# EAGLE design M307foo (EAGLE 4.11)
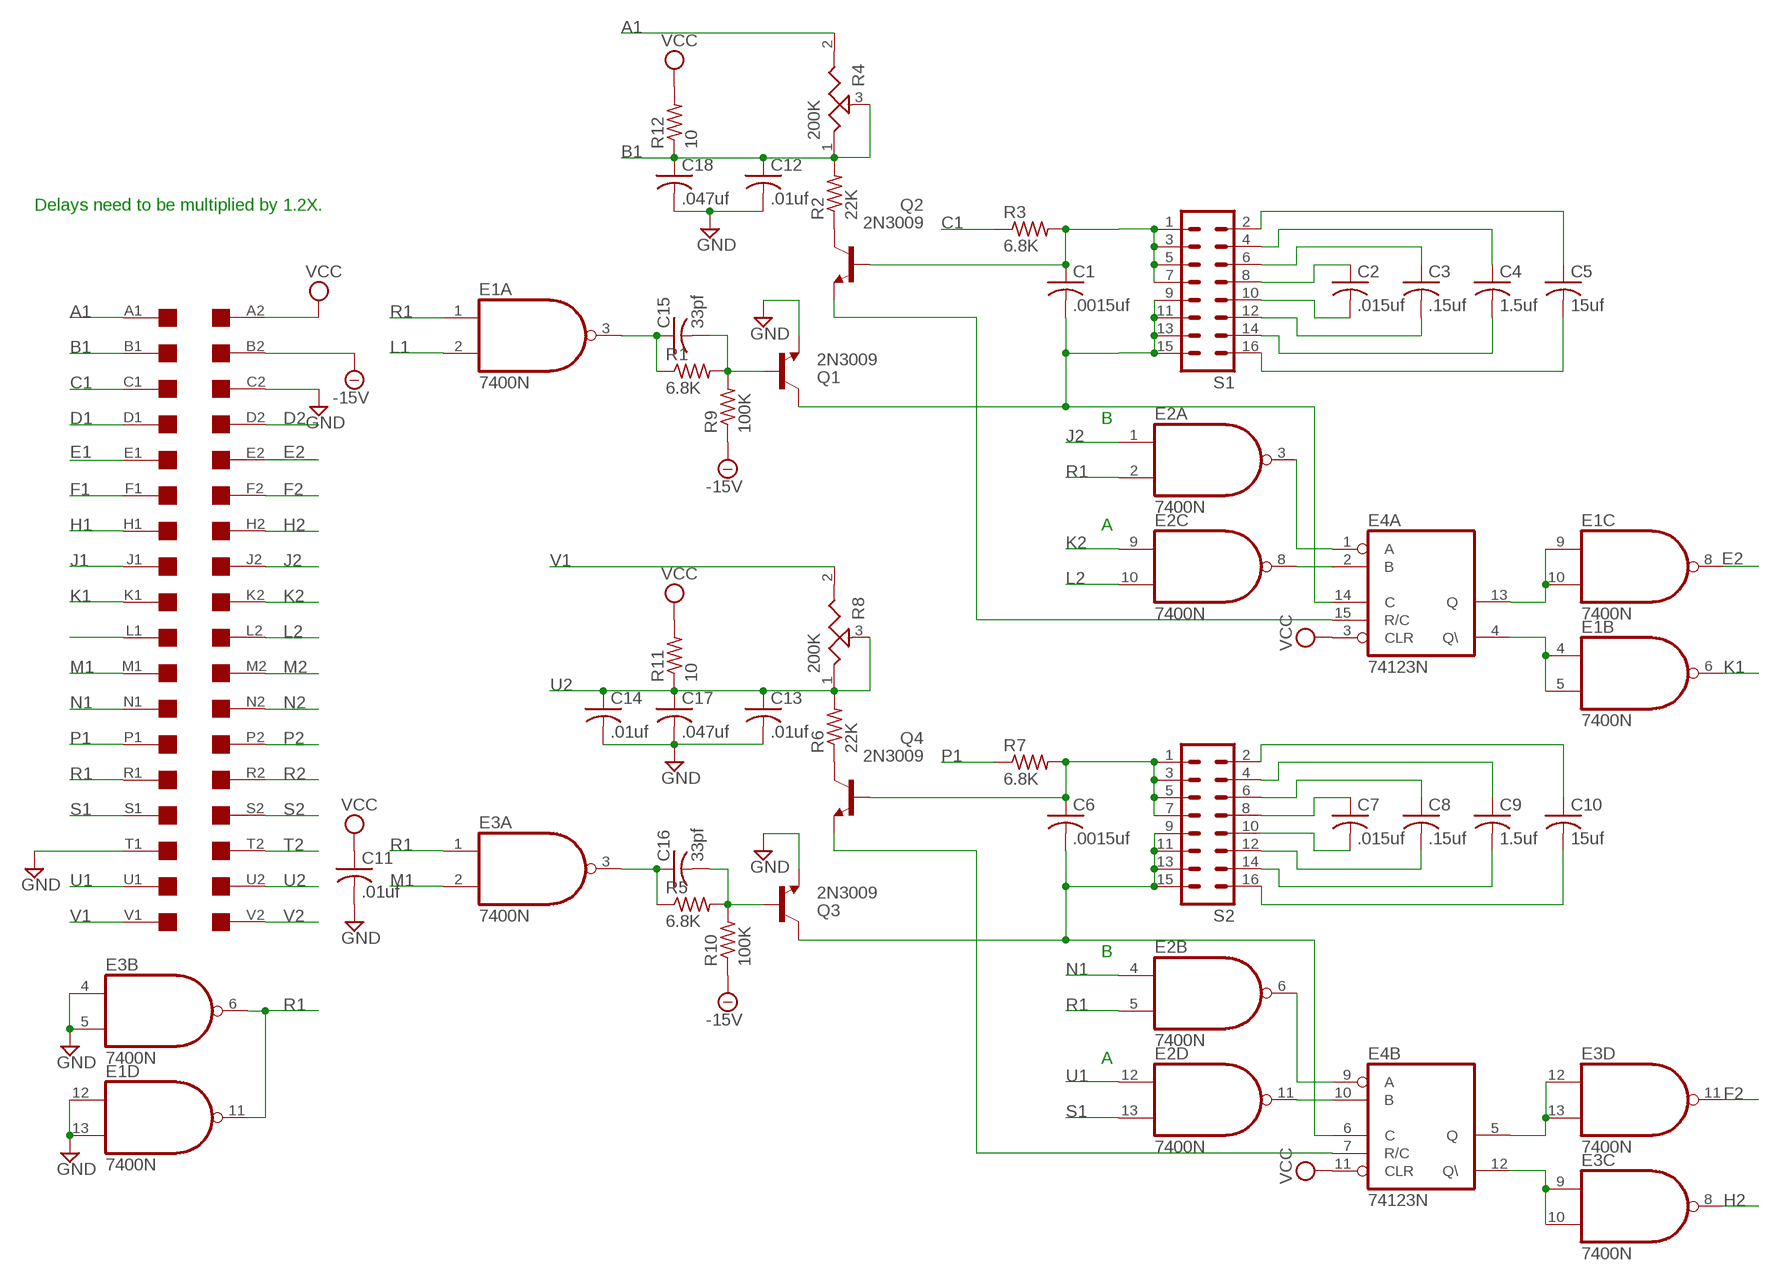
[diagram p0: schematic, sheet 1]

## Parts
A  DEC-FLIPCHIP  [DEC-FLIPCHIP]
C1  .0015uf  C-US050-025X075  [C050-025X075]
C2  .015uf  C-US050-025X075  [C050-025X075]
C3  .15uf  C-US050-025X075  [C050-025X075]
C4  1.5uf  C-US050-025X075  [C050-025X075]
C5  15uf  C-US050-025X075  [C050-025X075]
C6  .0015uf  C-US050-025X075  [C050-025X075]
C7  .015uf  C-US050-025X075  [C050-025X075]
C8  .15uf  C-US050-025X075  [C050-025X075]
C9  1.5uf  C-US050-025X075  [C050-025X075]
C10  15uf  C-US050-025X075  [C050-025X075]
C11  .01uf  C-US050-025X075  [C050-025X075]
C12  .01uf  C-US050-025X075  [C050-025X075]
C13  .01uf  C-US050-025X075  [C050-025X075]
C14  .01uf  C-US050-025X075  [C050-025X075]
C15  33pf  C-US050-025X075  [C050-025X075]
C16  33pf  C-US050-025X075  [C050-025X075]
C17  .047uf  C-US050-025X075  [C050-025X075]
C18  .047uf  C-US050-025X075  [C050-025X075]
E1  7400N  [DIL14]
E2  7400N  [DIL14]
E3  7400N  [DIL14]
E4  74123N  [DIL16]
Q1  2N3009  2N3019-NPN-TO39-EBC  [TO39]
Q2  2N3009  2N3019-NPN-TO39-EBC  [TO39]
Q3  2N3009  2N3019-NPN-TO39-EBC  [TO39]
Q4  2N3009  2N3019-NPN-TO39-EBC  [TO39]
R1  6.8K  R-US_0207/10  [0207/10]
R2  22K  R-US_0207/10  [0207/10]
R3  6.8K  R-US_0207/10  [0207/10]
R4  200K  POTUS-TRIM  [PT-SPIN]
R5  6.8K  R-US_0207/10  [0207/10]
R6  22K  R-US_0207/10  [0207/10]
R7  6.8K  R-US_0207/10  [0207/10]
R8  200K  POTUS-TRIM  [PT-SPIN]
R9  100K  R-US_0207/10  [0207/10]
R10  100K  R-US_0207/10  [0207/10]
R11  10  R-US_0207/10  [0207/10]
R12  10  R-US_0207/10  [0207/10]
S1  MA08-2  [MA08-2]
S2  MA08-2  [MA08-2]

## Nets
-15V: A.B2 R9.1 R10.1
A1: A.A1 R4.2
B1: A.B1 C12.1 C18.1 R2.2 R4.1 R4.3 R12.1
C1: A.C1 R3.1
CX1: C1.2 E4.14(A:C) Q1.3(C) S1.9 S1.11 S1.13 S1.15
CX2: C6.2 E4.6(B:C) Q3.3(C) S2.9 S2.11 S2.13 S2.15
D1: A.D1
D2: A.D2
E1: A.E1
E2: A.E2 E1.8(C:O)
F1: A.F1
F2: A.F2 E3.11(D:O)
GND: A.C2 A.T1 C11.2 C12.2 C13.2 C14.2 C17.2 C18.2 E1.12(D:I0) E1.13(D:I1) E3.4(B:I0) E3.5(B:I1) Q1.1(E) Q3.1(E)
H1: A.H1
H2: A.H2 E3.8(C:O)
J1: A.J1
J2: A.J2 E2.1(A:I0)
K1: A.K1 E1.6(B:O)
K2: A.K2 E2.9(C:I0)
L1: A.L1 E1.2(A:I1)
L2: A.L2 E2.10(C:I1)
M1: A.M1 E3.2(A:I1)
M2: A.M2
N1: A.N1 E2.4(B:I0)
N2: A.N2
N$1: C1.1 Q2.2(B) R3.2 S1.1 S1.3 S1.5 S1.7
N$2: E4.15(A:R/C) Q2.1(E)
N$3: C4.2 S1.14
N$4: C4.1 S1.4
N$5: C3.1 S1.6
N$6: C3.2 S1.12
N$7: C2.2 S1.10
N$8: C2.1 S1.8
N$9: C5.2 S1.16
N$10: C5.1 S1.2
N$11: E2.3(A:O) E4.1(A:A)
N$12: E2.8(C:O) E4.2(A:B)
N$13: E2.6(B:O) E4.9(B:A)
N$14: E2.11(D:O) E4.10(B:B)
N$15: E4.7(B:R/C) Q4.1(E)
N$16: Q2.3(C) R2.1
N$17: C6.1 Q4.2(B) R7.2 S2.1 S2.3 S2.5 S2.7
N$18: C10.2 S2.16
N$19: C10.1 S2.2
N$20: C9.1 S2.4
N$21: C8.1 S2.6
N$22: C7.1 S2.8
N$23: C7.2 S2.10
N$24: C8.2 S2.12
N$25: C9.2 S2.14
N$26: Q4.3(C) R6.1
N$27: E1.9(C:I0) E1.10(C:I1) E4.13(A:Q)
N$28: E1.4(B:I0) E1.5(B:I1) E4.4(A:Q\)
N$29: E3.12(D:I0) E3.13(D:I1) E4.5(B:Q)
N$30: C15.1 E1.3(A:O) R1.1
N$31: C15.2 Q1.2(B) R1.2 R9.2
N$32: E3.9(C:I0) E3.10(C:I1) E4.12(B:Q\)
N$33: C16.2 Q3.2(B) R5.2 R10.2
N$34: C16.1 E3.3(A:O) R5.1
P1: A.P1 R7.1
P2: A.P2
R1: A.R1 E1.1(A:I0) E1.11(D:O) E2.2(A:I1) E2.5(B:I1) E3.1(A:I0) E3.6(B:O)
R2: A.R2
S1: A.S1 E2.13(D:I1)
S2: A.S2
T2: A.T2
U1: A.U1 E2.12(D:I0)
U2: A.U2 C13.1 C14.1 C17.1 R6.2 R8.1 R8.3 R11.1
V1: A.V1 R8.2
V2: A.V2
VCC: A.A2 C11.1 E4.3(A:CLR) E4.11(B:CLR) R11.2 R12.2

## Notes on the sheet
- Delays need to be multiplied by 1.2X.
- B
- A
- B
- A

## Power pins joined to a net without a drawn wire
GND: E1.7(P:GND) E2.7(P:GND) E3.7(P:GND) E4.8(P:GND)
VCC: E1.14(P:VCC) E2.14(P:VCC) E3.14(P:VCC) E4.16(P:VCC)

## Library data of the parts
A = con-dec:DEC-FLIPCHIP: Two-sided DEC Flip-Chip single card fingers
C1-C18 = rcl:C-US: CAPACITOR, American symbol
E1-E3 = 74xx-us:74*00: Quad 2-input NAND gate
E4 = 74xx-us:74*123: Retriggerable monostable MULTIVIBRATOR
Q1-Q4 = transistor:*-NPN-: NPN Transistror
R1-R3 R5-R7 R9-R12 = rcl:R-US_: RESISTOR, American symbol
R4 R8 = discrete:POTUS-TRIM
S1 S2 = con-lstb:MA08-2: PIN HEADER

## Board
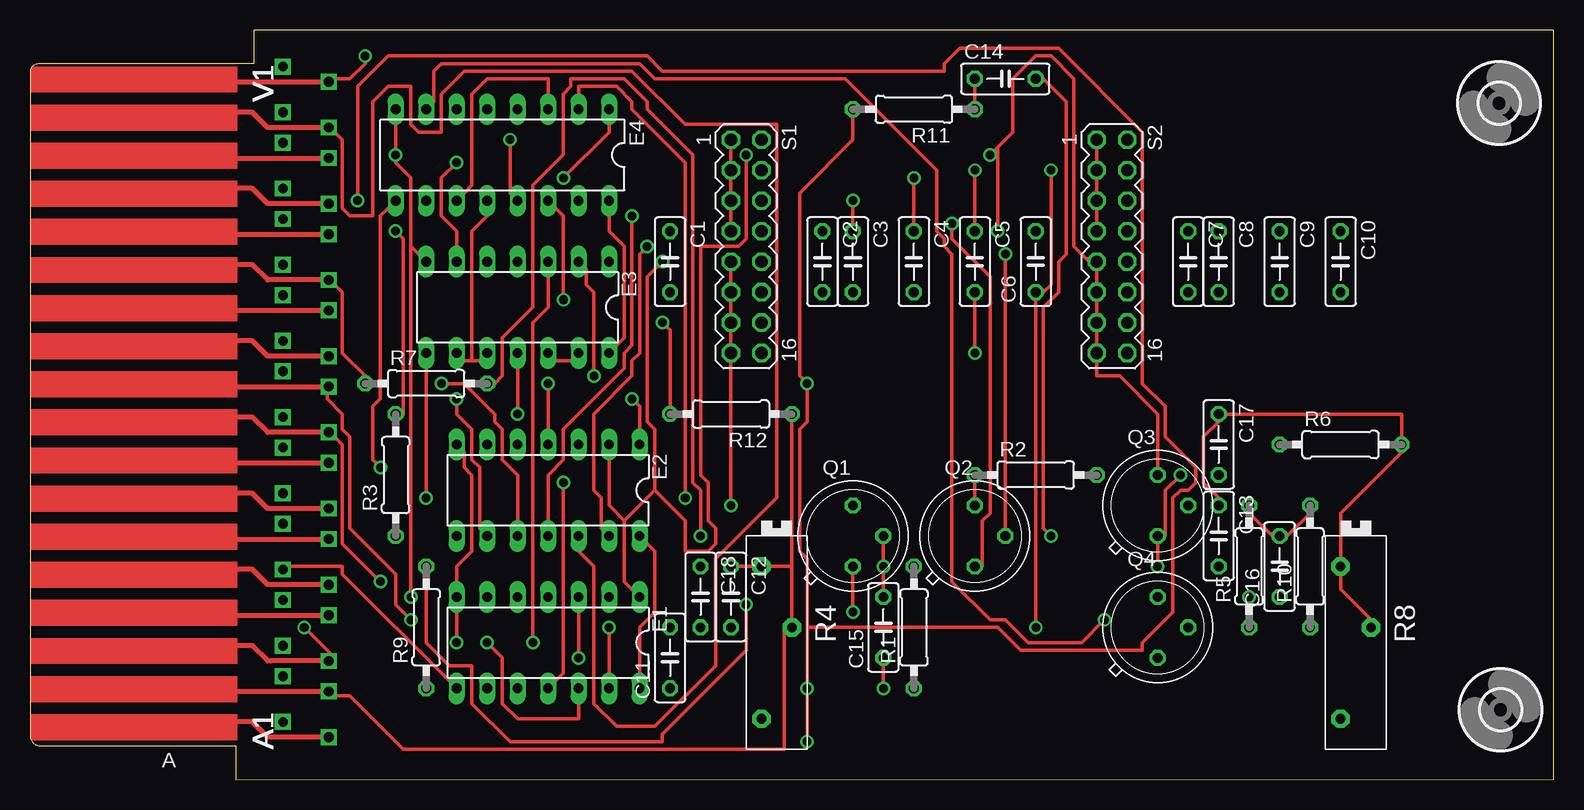
[diagram p1: board, top side]
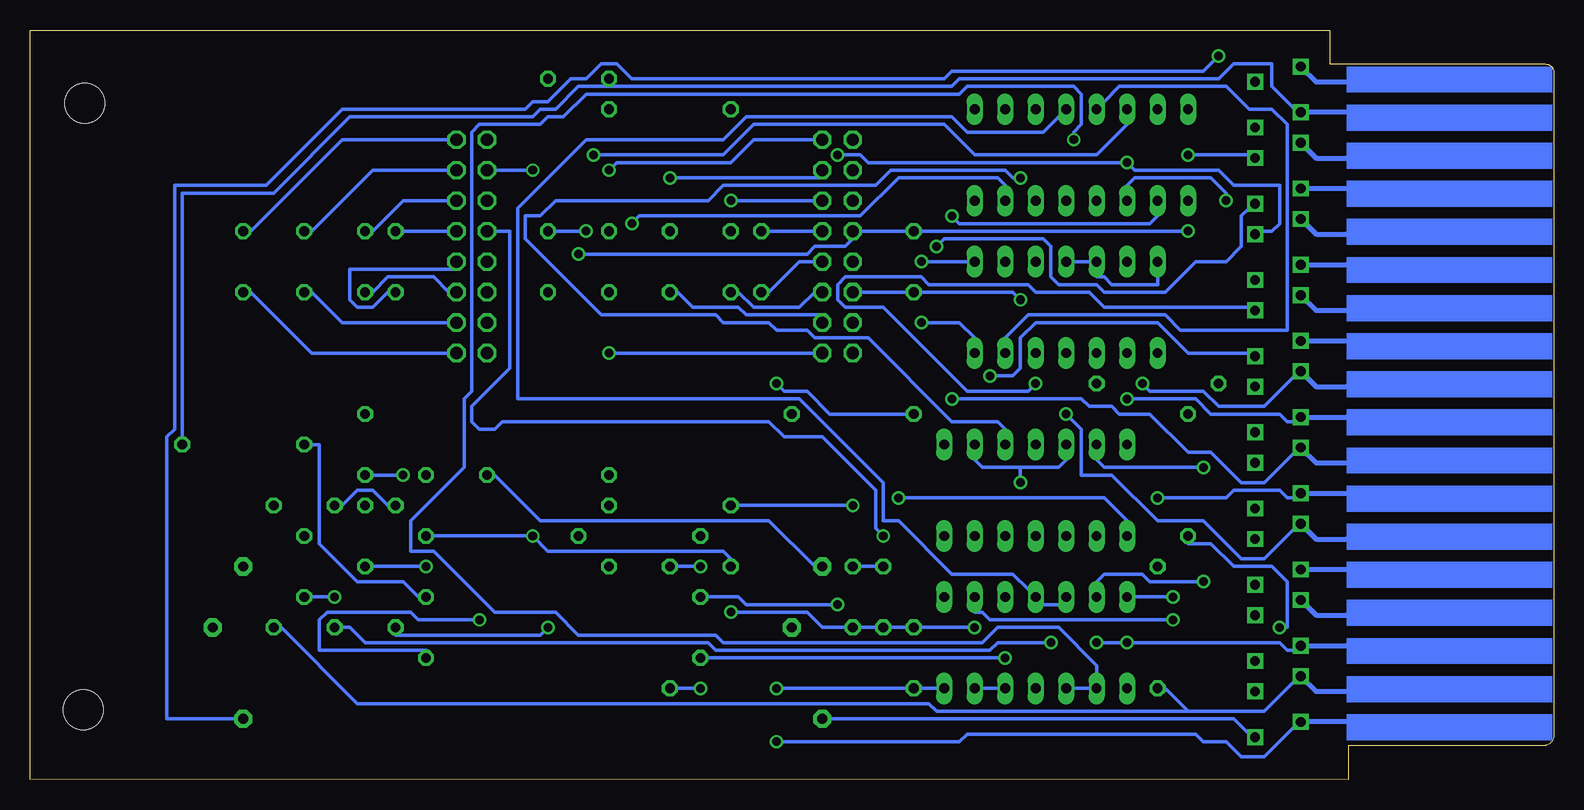
[diagram p2: board, bottom side, seen from below]

Size 126.98 x 62.48 mm. Coordinates in mm from the lower left corner, seen from the top.
Outline: 17.14,2.83 17.14,0 126.98,0.04 126.98,62.45 18.66,62.48 18.66,59.65 0.69,59.65 arc90 0,58.96 0,3.72 arc90 0.89,2.83 17.14,2.83
Copper layers (1*16): Top 0.035mm / dielectric 1.5mm / Bottom 0.035mm
Design rules "10mils": minimum track width 12mil, minimum drill 28mil, track to track 10mil, track to pad 10mil, pad to pad 10mil, via to via 10mil, smd to smd 10mil, copper to edge 40mil, drill to drill 10mil, minimum pad ring 10mil, minimum via ring 8mil, stop-mask expansion 0mil, vias tented up to drill 0mil, thermal gap 10mil

### Footprints (pad centres in the part's own frame; a part is rotated, then mirrored left to right if it is on the bottom)
DEC-FLIPCHIP = drill 0.813 square: A1 -7.62,27.94; A2 -3.81,26.67; B1 -7.62,24.13; B2 -3.81,22.86; C1 -7.62,21.59; C2 -3.81,20.32; D1 -7.62,17.78; D2 -3.81,16.51; E1 -7.62,15.24; E2 -3.81,13.97; F1 -7.62,11.43; F2 -3.81,10.16; H1 -7.62,8.89; H2 -3.81,7.62; J1 -7.62,5.08; J2 -3.81,3.81; K1 -7.62,2.54; K2 -3.81,1.27; L1 -7.62,-1.27; L2 -3.81,-2.54; M1 -7.62,-3.81; M2 -3.81,-5.08; N1 -7.62,-7.62; N2 -3.81,-8.89; P1 -7.62,-10.16; P2 -3.81,-11.43; R1 -7.62,-13.97; R2 -3.81,-15.24; S1 -7.62,-16.51; S2 -3.81,-17.78; T1 -7.62,-20.32; T2 -3.81,-21.59; U1 -7.62,-22.86; U2 -3.81,-24.13; V1 -7.62,-26.67; V2 -3.81,-27.94
C050-025X075 = drill 0.813 octagon: 1 -2.54,0; 2 2.54,0
DIL14 = drill 0.813 long: 1 -7.62,-3.81; 2 -5.08,-3.81; 3 -2.54,-3.81; 4 0,-3.81; 5 2.54,-3.81; 6 5.08,-3.81; 7 7.62,-3.81; 8 7.62,3.81; 9 5.08,3.81; 10 2.54,3.81; 11 0,3.81; 12 -2.54,3.81; 13 -5.08,3.81; 14 -7.62,3.81
DIL16 = drill 0.813 long: 1 -8.89,-3.81; 2 -6.35,-3.81; 3 -3.81,-3.81; 4 -1.27,-3.81; 5 1.27,-3.81; 6 3.81,-3.81; 7 6.35,-3.81; 8 8.89,-3.81; 9 8.89,3.81; 10 6.35,3.81; 11 3.81,3.81; 12 1.27,3.81; 13 -1.27,3.81; 14 -3.81,3.81; 15 -6.35,3.81; 16 -8.89,3.81
TO39 = drill 0.813 octagon: 1 0,-2.54; 2 2.54,0; 3 0,2.54
0207/10 = drill 0.813 octagon: 1 -5.08,0; 2 5.08,0
PT-SPIN = drill 0.813 pad 1.524 octagon: 1 -6.35,-1.27; 2 6.35,-1.27; 3 -1.27,1.27
MA08-2 = drill 1.016 octagon: 1 -8.89,-1.27; 2 -8.89,1.27; 3 -6.35,-1.27; 4 -6.35,1.27; 5 -3.81,-1.27; 6 -3.81,1.27; 7 -1.27,-1.27; 8 -1.27,1.27; 9 1.27,-1.27; 10 1.27,1.27; 11 3.81,-1.27; 12 3.81,1.27; 13 6.35,-1.27; 14 6.35,1.27; 15 8.89,-1.27; 16 8.89,1.27
3,3 = hole 3.3: 0,0

### Placement (x,y rotation side)
A  17.27,31.5 180 top
C1  53.34,43.18 270 top
C2  66.04,43.18 270 top
C3  68.58,43.18 270 top
C4  73.66,43.18 270 top
C5  78.73,43.18 270 top
C6  83.81,43.18 90 top
C7  96.52,43.18 270 top
C8  99.06,43.18 270 top
C9  104.14,43.18 270 top
C10  109.22,43.18 270 top
C11  53.34,10.16 90 top
C12  58.41,15.24 270 top
C13  99.06,20.32 270 top
C14  81.28,58.42 0 top
C15  71.12,12.7 90 top
C16  104.14,17.78 90 top
C17  99.06,27.94 270 top
C18  55.88,15.24 270 top
E1  43.17,11.43 180 top
E2  43.17,24.13 180 top
E3  40.63,39.37 180 top
E4  39.36,52.07 180 top
Q1  68.58,20.32 0 top
Q2  78.73,20.32 0 top
Q3  93.98,22.86 0 top
Q4  93.98,12.7 0 top
R1  73.66,12.7 90 top
R2  83.81,25.4 0 top
R3  30.48,25.4 90 top
R4  62.22,11.43 270 top
R5  101.59,17.78 90 top
R6  109.22,27.94 0 top
R7  33.02,33.02 0 top
R8  110.48,11.43 270 top
R9  33.02,12.7 90 top
R10  106.68,17.78 90 top
R11  73.66,55.88 180 top
R12  58.41,30.48 180 top
S1  59.68,44.45 270 top
S2  90.17,44.45 270 top
U$2  [3,3]  122.42,56.39 0 top
U$3  [3,3]  122.55,5.84 0 top

### Tracks (layer width: path | path; a pad name or v marks a point on that pad's centre or on a via)
-15V
  Bottom 0.305: 30.48,5.71 24.12,5.71 21.59,8.26 A.B2 | 30.48,5.71 32.38,7.62 R9.1 | 30.48,5.71 51.43,5.71 52.06,6.35 99.69,6.35 106.04,12.7 R10.1
A1
  Bottom 0.305: A.A1 25.39,3.81 26.67,5.08 60.32,5.08 R4.2
B1
  Top 0.305: C12.1 59.05,17.78 60.32,17.78 R4.1 61.59,17.78 63.49,17.78 | A.B1 25.39,6.99 26.67,6.99 31.11,2.54 62.86,2.54 62.86,12.7 R4.3 63.49,13.34 63.49,17.78 | 63.49,17.78 63.49,29.84 R12.1
  Bottom 0.305: C18.1 56.51,17.78 57.78,17.78 C12.1 | R2.2 88.26,25.4 84.45,21.59 65.4,21.59 61.59,17.78 R4.1
C1  (via drill 0.71)
  Top 0.305: v22.86,12.7 25.39,10.16 A.C1
  Bottom 0.305: v22.86,12.7 22.22,12.7 22.22,16.51 23.49,17.78 26.67,17.78 28.57,19.68 30.48,19.68 R3.1
CX1  (via drill 0.71)
  Top 0.305: v44.45,40.01 44.45,46.99 43.81,47.62 E4.14 | S1.9 58.41,42.55 58.41,41.27 S1.11 58.41,40.01 58.41,38.73 S1.13 58.41,37.47 58.41,36.2 S1.15 58.41,34.92 v58.41,22.86
  Bottom 0.305: v44.45,40.01 45.08,40.64 52.7,40.64 C1.2 53.97,40.64 57.78,40.64 S1.11 | v58.41,22.86 67.94,22.86 Q1.3
CX2  (via drill 0.71)
  Top 0.305: Q3.3 93.98,26.04 93.98,30.48 90.8,33.66 88.9,33.66 88.9,34.92 S2.15 88.9,36.2 88.9,37.47 S2.13 88.9,38.73 88.9,40.01 S2.11 88.9,41.27 88.9,42.55 S2.9 88.26,43.18 86.99,44.45 86.99,58.42 85.09,60.33 83.81,60.33 81.91,58.42 81.91,53.98 80.64,52.7 | v80.01,52.07 80.64,52.7 | 80.64,52.7 v80.64,45.72
  Bottom 0.305: v80.01,52.07 69.21,52.07 66.67,54.61 50.79,54.61 48.25,52.07 38.09,52.07 35.55,54.61 E4.6 | v80.64,45.72 83.18,45.72 C6.2
E2
  Top 0.305: E1.8 34.92,8.26 26.03,17.14 26.03,17.78 21.59,17.78 A.E2
F2  (via drill 0.71)
  Top 0.305: v40.63,30.48 40.63,34.29 E3.11
  Bottom 0.305: v40.63,30.48 39.36,29.21 39.36,25.4 36.82,25.4 33.02,21.59 29.21,21.59 26.03,18.41 24.12,18.41 21.59,20.95 A.F2
GND  (via drill 0.71)
  Top 0.305: E4.8 30.48,54.61 v30.48,52.07 30.48,51.44 31.75,50.16 31.75,44.45 | 31.75,44.45 32.38,43.81 E3.7 | v35.55,11.43 35.55,13.97 E1.7 35.55,16.51 35.55,17.78 36.82,19.05 36.82,25.4 36.19,26.04 36.19,27.3 E2.7 | v31.75,15.24 31.75,44.45 | v68.58,13.97 68.58,17.14 Q1.1 | v48.25,12.7 48.25,8.89 E1.13 | v93.98,17.78 93.98,19.68 Q3.1 94.61,20.32 94.61,24.13 v95.88,25.4 | v85.09,20.32 84.45,20.95 84.45,39.37 85.72,40.64 85.72,43.18 86.36,43.81 86.36,56.52 84.45,58.42 C14.2 | v38.09,11.43 39.36,10.16 39.36,6.35 40.63,5.08 45.71,5.08 45.71,6.35 E1.12
  Bottom 0.305: E3.7 33.02,41.91 33.02,41.27 36.82,41.27 37.46,41.91 38.09,41.91 E3.5 38.73,43.18 40,43.18 E3.4 | v30.48,52.07 25.39,52.07 A.T1 | A.C2 21.59,10.79 22.22,10.79 22.86,11.43 v35.55,11.43 v38.09,11.43 | v31.75,15.24 34.92,15.24 E1.7 | E1.12 46.35,7.62 47.62,7.62 E1.13 | v68.58,13.97 62.22,13.97 60.95,12.7 59.05,12.7 C12.2 57.78,12.7 56.51,12.7 C18.2 55.24,12.7 53.97,12.7 C11.2 52.7,12.7 v48.25,12.7 | v93.98,17.78 98.42,17.78 C13.2 | v95.88,25.4 98.42,25.4 C17.2 | Q3.1 93.34,20.32 v85.09,20.32 83.81,19.05 69.21,19.05 68.58,18.41 Q1.1
H2  (via drill 0.71)
  Top 0.305: v33.02,23.5 33.02,34.29 E3.8
  Bottom 0.305: v33.02,23.5 27.3,23.5 26.67,24.13 22.86,24.13 22.22,23.5 21.59,23.5 A.H2
J2  (via drill 0.71)
  Top 0.305: v50.16,31.75 50.79,31.11 50.79,29.21 E2.1
  Bottom 0.305: v50.16,31.75 39.36,31.75 38.73,31.11 36.82,31.11 36.19,30.48 33.65,30.48 30.48,27.3 28.57,27.3 26.03,24.77 24.12,24.77 21.59,27.3 A.J2
K1  (via drill 0.71)
  Top 0.305: v29.21,16.51 26.03,19.68 26.03,27.94 25.39,28.57 A.K1
  Bottom 0.305: v29.21,16.51 33.65,16.51 34.28,17.14 37.46,17.14 38.09,16.51 E1.6
K2  (via drill 0.71)
  Top 0.305: v35.55,31.75 35.55,30.48 36.82,29.21 36.82,26.67 37.46,26.04 37.46,20.95 E2.9
  Bottom 0.305: v35.55,31.75 29.84,31.75 28.57,30.48 22.86,30.48 22.22,29.84 21.59,29.84 A.K2
L1  (via drill 0.71)
  Top 0.305: v31.75,13.34 30.48,14.61 30.48,17.14 26.67,20.95 26.67,28.57 26.03,29.21 26.03,30.48 24.76,31.75 24.76,32.38 A.L1
  Bottom 0.305: v31.75,13.34 46.98,13.34 47.62,13.97 48.25,13.97 E1.2
L2  (via drill 0.71)
  Top 0.305: v34.28,33.02 36.19,33.02 38.73,30.48 38.73,29.84 39.36,29.21 39.36,26.67 40.63,25.4 40.63,21.59 E2.10
  Bottom 0.305: v34.28,33.02 33.65,32.38 29.21,32.38 27.94,31.11 24.12,31.11 21.59,33.66 A.L2
M1  (via drill 0.71)
  Top 0.305: v46.98,33.66 46.98,40.64 46.35,41.27 46.35,42.55 E3.2
  Bottom 0.305: v46.98,33.66 45.08,33.66 44.45,34.29 44.45,36.83 43.17,38.1 33.02,38.1 30.48,35.56 25.39,35.56 A.M1
N1  (via drill 0.71)
  Top 0.305: v43.17,33.02 43.17,29.21 E2.4
  Bottom 0.305: v43.17,33.02 43.81,32.38 48.89,32.38 55.88,39.37 59.05,39.37 59.68,40.01 59.68,41.27 59.05,41.91 52.7,41.91 52.06,41.27 43.81,41.27 43.17,40.64 38.73,40.64 37.46,39.37 25.39,39.37 A.N1
N$1  (via drill 0.71)
  Top 0.305: v30.48,45.72 31.11,45.09 31.11,30.48 R3.2 | S1.7 58.41,46.35 58.41,47.62 S1.5 58.41,48.9 58.41,50.16 S1.3 58.41,51.44 58.41,52.7 S1.1 | v81.28,43.81 81.28,20.95 Q2.2
  Bottom 0.305: v30.48,45.72 52.7,45.72 C1.1 53.97,45.72 57.78,45.72 S1.7 58.41,45.09 59.05,44.45 61.59,44.45 62.22,43.81 v81.28,43.81
N$2  (via drill 0.71)
  Top 0.305: v76.83,46.35 76.83,45.09 80.01,41.91 80.01,22.23 79.37,21.59 79.37,17.78 Q2.1
  Bottom 0.305: v76.83,46.35 76.2,46.99 57.78,46.99 54.6,50.16 46.35,50.16 45.71,49.53 E4.15
N$3
  Bottom 0.305: C4.2 73.02,40.64 71.75,39.37 67.94,39.37 67.31,38.73 60.95,38.73 S1.14
N$4  (via drill 0.71)
  Top 0.305: v73.66,50.16 73.66,46.35 C4.1
  Bottom 0.305: v73.66,50.16 60.95,50.16 S1.4
N$5  (via drill 0.71)
  Top 0.305: v68.58,48.26 68.58,46.35 C3.1
  Bottom 0.305: v68.58,48.26 61.59,48.26 S1.6
N$6
  Bottom 0.305: C3.2 67.94,40.64 66.67,39.37 62.86,39.37 61.59,40.64 S1.12
N$7
  Bottom 0.305: C2.2 65.4,40.64 62.86,43.18 61.59,43.18 S1.10
N$8
  Bottom 0.305: C2.1 65.4,45.72 61.59,45.72 S1.8
N$9  (via drill 0.71)
  Top 0.305: v78.73,35.56 78.73,40.01 C5.2
  Bottom 0.305: v78.73,35.56 61.59,35.56 S1.16
N$10  (via drill 0.71)
  Top 0.305: v78.73,50.8 78.73,46.35 C5.1
  Bottom 0.305: v78.73,50.8 78.1,51.44 68.58,51.44 66.67,53.34 61.59,53.34 S1.2
N$11  (via drill 0.71)
  Top 0.305: v44.45,50.16 48.25,53.98 48.25,54.61 E4.1
  Bottom 0.305: v44.45,50.16 45.08,50.16 45.71,50.8 55.24,50.8 56.51,49.53 69.21,49.53 70.48,48.26 83.18,48.26 84.45,46.99 85.72,46.99 85.72,45.09 79.37,38.73 69.84,38.73 69.21,38.1 65.4,38.1 64.77,37.47 62.22,37.47 61.59,36.83 57.14,36.83 50.16,29.84 46.35,29.84 45.71,29.21 E2.3
N$12  (via drill 0.71)
  Top 0.305: v54.6,23.5 54.6,51.44 50.16,55.88 50.16,56.52 48.89,57.78 45.71,57.78 45.71,57.15 E4.2
  Bottom 0.305: v54.6,23.5 37.46,23.5 35.55,21.59 E2.8
N$13  (via drill 0.71)
  Top 0.305: v29.21,26.04 28.57,26.67 28.57,31.11 29.21,31.75 29.21,46.99 29.84,47.62 E4.9
  Bottom 0.305: v29.21,26.04 37.46,26.04 38.09,26.67 E2.6
N$14  (via drill 0.71)
  Top 0.305: v50.16,46.99 50.16,36.2 49.52,35.56 49.52,34.29 44.45,29.21 44.45,26.67 43.17,25.4 43.17,21.59 E2.11
  Bottom 0.305: v50.16,46.99 49.52,46.35 33.65,46.35 33.02,46.99 E4.10
N$15  (via drill 0.71)
  Top 0.305: v89.53,13.34 87.62,11.43 83.18,11.43 81.28,13.34 80.01,13.34 76.83,16.51 76.83,43.81 76.2,44.45 76.2,45.09 75.56,45.72 75.56,50.8 67.94,58.42 52.06,58.42 50.79,59.69 34.28,59.69 33.65,59.05 33.65,56.52 E4.7
  Bottom 0.305: v89.53,13.34 94.61,13.34 95.25,13.97 102.23,13.97 102.87,13.34 102.87,10.79 93.98,10.79 Q4.1
N$16
  Top 0.305: Q2.3 78.73,23.5 78.73,24.77 R2.1
N$17  (via drill 0.71)
  Top 0.305: v85.09,50.8 85.09,41.27 84.45,40.64 C6.1 83.81,40.01 v83.81,12.7 | S2.1 88.9,52.7 88.9,51.44 S2.3 88.9,50.16 88.9,48.9 S2.5 88.9,47.62 88.9,46.35 S2.7 | v55.88,20.32 55.88,24.13 55.24,24.77 55.24,52.07 51.43,55.88 51.43,56.52 49.52,58.42 45.08,58.42 45.08,57.78 44.45,57.15 44.45,52.07 41.9,49.53 41.9,39.37 39.36,36.83 39.36,33.66 38.73,33.02 R7.2
  Bottom 0.305: v85.09,50.8 88.26,50.8 S2.3 | v83.81,12.7 84.45,12.06 96.52,12.06 Q4.2 | v55.88,20.32 56.51,20.95 56.51,24.13 60.95,28.57 64.13,28.57 65.4,29.84 87.62,29.84 88.26,29.21 89.53,29.21 90.17,29.84 90.17,31.11 86.99,34.29 86.99,45.72 88.26,45.72 S2.7
N$18
  Bottom 0.305: C10.2 108.58,40.64 103.5,35.56 92.07,35.56 S2.16
N$19
  Bottom 0.305: C10.1 108.58,45.72 100.96,53.34 92.07,53.34 S2.2
N$20
  Bottom 0.305: C9.1 103.5,45.72 98.42,50.8 92.07,50.8 S2.4
N$21
  Bottom 0.305: C8.1 98.42,45.72 95.88,48.26 92.07,48.26 S2.6
N$22
  Bottom 0.305: C7.1 95.88,45.72 92.07,45.72 S2.8
N$23
  Bottom 0.305: C7.2 97.15,40.64 98.42,39.37 99.69,39.37 100.33,40.01 100.33,42.55 91.44,42.55 S2.10
N$24
  Bottom 0.305: C8.2 98.42,40.64 97.15,41.91 93.34,41.91 92.07,40.64 S2.12
N$25
  Bottom 0.305: C9.2 103.5,40.64 100.96,38.1 92.07,38.1 S2.14
N$26
  Bottom 0.305: Q4.3 94.61,15.24 95.88,16.51 99.69,16.51 102.87,19.68 102.87,27.94 103.5,27.94 R6.1
N$27  (via drill 0.71)
  Top 0.305: v40,53.34 40,48.9 E4.13
  Bottom 0.305: E1.10 40,7.62 38.73,7.62 E1.9 38.09,8.89 38.09,9.53 41.27,12.7 46.35,12.7 47.62,11.43 69.21,11.43 69.84,12.06 81.28,12.06 83.18,13.97 88.26,13.97 93.34,19.05 95.25,19.05 95.25,21.59 90.8,26.04 90.8,31.75 90.17,32.38 90.17,53.98 89.53,54.61 84.45,54.61 83.81,55.24 82.55,55.24 80.64,57.15 49.52,57.15 48.89,57.78 40,57.78 39.36,57.15 39.36,54.61 40,53.98 v40,53.34
N$28
  Bottom 0.305: E1.5 41.27,14.61 42.54,14.61 E1.4 43.81,15.88 45.08,17.14 50.16,17.14 54.6,21.59 55.88,21.59 55.88,24.77 62.86,31.75 86.36,31.75 86.36,47.62 80.64,53.34 69.21,53.34 67.31,55.24 50.16,55.24 48.89,53.98 42.54,53.98 41.27,55.24 E4.4
N$29
  Top 0.305: E3.12 43.81,34.92 45.08,34.92 E3.13
  Bottom 0.305: E4.5 37.46,56.52 36.19,57.78 27.3,57.78 25.39,55.88 23.49,55.88 22.22,54.61 22.22,37.47 31.11,37.47 32.38,38.73 43.81,38.73 45.71,36.83 E3.13
N$30  (via drill 0.71)
  Top 0.305: v45.71,10.16 45.71,13.97 E1.3 | v71.12,7.62 71.12,9.53 C15.1
  Bottom 0.305: v45.71,10.16 70.48,10.16 C15.1 | v71.12,7.62 73.02,7.62 R1.1
N$31  (via drill 0.71)
  Top 0.305: Q1.2 71.12,19.68 v71.12,17.78 71.12,15.88 C15.2 | v59.68,14.61 59.68,10.79 52.7,3.81 52.7,3.17 40,3.17 36.82,6.35 36.82,9.53 34.92,9.53 33.02,11.43 33.02,17.14 R9.2
  Bottom 0.305: v71.12,17.78 73.02,17.78 R1.2 | v59.68,14.61 67.31,14.61 67.94,15.24 70.48,15.24 C15.2
N$32
  Top 0.305: 36.82,34.92 37.46,34.92 E3.10 | 36.82,34.92 36.19,34.92 E3.9 | 36.82,34.92 36.82,45.72 38.09,46.99 E4.12
N$33
  Top 0.305: R5.2 101.59,22.23 103.5,20.32 C16.2 104.77,20.32 106.68,22.23 R10.2
  Bottom 0.305: Q3.2 97.15,22.86 98.42,24.13 99.69,24.13 100.96,22.86 R5.2
N$34  (via drill 0.71)
  Top 0.305: v41.9,11.43 41.9,38.1 43.17,39.37 43.17,41.91 E3.3 | v101.59,15.24 101.59,13.34 R5.1
  Bottom 0.305: v41.9,11.43 46.35,11.43 46.98,10.79 69.84,10.79 70.48,11.43 99.06,11.43 100.33,12.7 100.96,12.7 R5.1 | v101.59,15.24 103.5,15.24 C16.1
P1
  Top 0.305: R7.1 27.94,33.66 26.03,35.56 26.03,40.64 25.39,41.27 A.P1
R1  (via drill 0.71)
  Top 0.305: v35.55,51.44 34.28,50.16 34.28,46.99 35.55,45.72 35.55,44.45 E3.6 | v44.45,24.77 44.45,8.89 43.81,8.26 E1.11 | 49.52,21.59 49.52,16.51 50.16,15.88 E1.1 | 49.52,21.59 48.25,22.86 48.25,26.67 E2.2 | v52.7,43.18 51.43,41.91 51.43,29.84 52.06,29.21 52.06,24.13 | 49.52,21.59 52.06,24.13 | v59.68,52.07 59.68,45.09 59.05,44.45 55.88,44.45 55.88,25.4 56.51,24.77 56.51,21.59 57.14,20.95 57.14,19.68 56.51,19.05 54.6,19.05 54.6,21.59 52.06,24.13
  Bottom 0.305: A.R1 24.76,45.72 23.49,45.72 22.86,46.35 22.86,49.53 26.67,49.53 27.94,50.8 34.92,50.8 v35.55,51.44 57.14,51.44 57.78,52.07 v59.68,52.07 | 44.45,26.04 41.27,26.04 40.63,26.67 E2.5 | 44.45,26.04 47.62,26.04 48.25,26.67 E2.2 | v44.45,24.77 44.45,26.04 | v52.7,43.18 48.89,43.18 E3.1
S1  (via drill 0.71)
  Top 0.305: v51.43,44.45 50.79,43.81 50.79,35.56 50.16,34.92 50.16,33.66 46.98,30.48 46.98,24.13 47.62,23.5 47.62,20.95 E2.13
  Bottom 0.305: v51.43,44.45 50.79,45.09 42.54,45.09 41.9,44.45 41.9,41.91 41.27,41.27 38.09,41.27 37.46,40.64 32.38,40.64 29.84,43.18 27.3,43.18 26.03,44.45 26.03,46.99 25.39,47.62 A.S1
U1
  Top 0.305: A.U1 25.39,53.98 26.03,53.34 26.03,47.62 26.67,46.99 28.57,46.99 28.57,56.52 29.84,57.78 31.75,57.78 31.75,54.61 32.38,53.98 34.28,53.98 34.28,57.15 36.19,59.05 50.16,59.05 54.6,54.61 62.22,54.61 62.22,23.5 57.14,18.41 57.14,9.53 52.06,4.45 48.89,4.45 46.98,6.35 46.98,17.78 45.71,19.05 E2.12
U2
  Top 0.305: C13.1 99.06,23.5 97.79,24.77 97.79,28.57 99.06,29.84 C17.1 99.69,30.48 114.3,30.48 114.3,28.57 R6.2 114.3,27.3 109.22,22.23 109.22,18.41 R8.1 109.22,17.14 109.22,15.88 111.76,13.34 R8.3 | R11.1 78.73,56.52 78.73,57.78 C14.1
  Bottom 0.305: 78.73,57.78 50.16,57.78 49.52,58.42 27.94,58.42 26.67,59.69 23.49,59.69 23.49,57.78 21.59,55.88 A.U2 | 78.73,57.78 C14.1 78.73,57.78 | 78.73,57.78 81.28,57.78 83.18,55.88 84.45,55.88 85.09,55.24 100.33,55.24 106.68,48.9 114.3,48.9 114.3,28.57 R6.2
V1  (via drill 0.71)
  Top 0.305: v27.94,60.33 27.94,59.69 26.67,58.42 25.39,58.42 A.V1
  Bottom 0.305: v27.94,60.33 29.21,59.05 50.16,59.05 50.79,58.42 76.83,58.42 78.1,59.69 79.37,59.69 80.64,58.42 81.91,58.42 83.81,56.52 85.09,56.52 85.72,55.88 100.96,55.88 107.31,49.53 114.93,49.53 114.93,29.21 115.56,28.57 115.56,5.08 109.85,5.08 R8.2
VCC  (via drill 0.71)
  Top 0.305: E4.11 36.19,48.9 36.82,49.53 36.82,57.15 38.09,58.42 43.17,58.42 43.17,57.15 E4.3 | E2.14 51.43,19.68 52.06,19.05 52.06,13.97 50.79,12.7 50.79,8.89 E1.14 | E3.14 48.89,36.2 49.52,36.83 49.52,44.45 48.25,45.72 48.25,46.99 E4.16 | 64.77,12.7 64.77,18.41 64.13,19.05 64.13,29.21 64.77,29.84 v64.77,33.02 64.13,33.66 64.13,48.9 68.58,53.34 68.58,55.24 R11.2 | 64.77,12.7 v64.77,7.62 v64.77,3.17 | v52.7,38.1 53.34,37.47 53.34,31.11 R12.2 | v27.3,48.26 27.3,57.78 29.84,60.33 51.43,60.33 52.7,59.05 76.2,59.05 76.2,59.69 77.47,60.96 85.72,60.96 92.7,53.98 92.7,33.02 94.61,31.11 94.61,28.57 97.15,26.04 97.15,24.77 96.52,24.13 95.88,24.13 95.25,23.5 95.25,13.97 92.7,11.43 92.7,10.79 82.55,10.79 80.64,12.7 64.77,12.7
  Bottom 0.305: E1.14 51.43,7.62 52.7,7.62 C11.1 53.97,7.62 v64.77,7.62 | v64.77,3.17 49.52,3.17 48.89,3.81 29.84,3.81 29.21,3.17 27.3,3.17 26.03,1.91 24.12,1.91 21.59,4.45 A.A2 | v64.77,33.02 64.13,32.38 62.22,32.38 60.32,30.48 53.97,30.48 R12.2 | v52.7,38.1 49.52,38.1 48.25,36.83 E3.14 | v27.3,48.26 27.3,48.9 28.57,50.16 34.92,50.16 35.55,49.53 E4.11

### Text on the board
tNames: V1 | V1 | V1 | V1 | V1 | V1 | V1 | V1 | V1 | V1 | V1 | V1 | V1 | V1 | V1 | V1 | V1 | V1 | V1 | V1 | V1 | V1 | V1 | V1 | V1 | V1 | V1 | V1 | V1 | V1 | V1 | V1 | A1 | A1 | A1 | A1 | A1 | A1 | A1 | A1 | A1 | A1 | A1 | A1 | A1 | A1 | A1 | A1 | A1 | A1 | A1 | A1 | A1 | A1 | A1 | A1 | A1 | A1 | A1 | A1 | A1 | A1 | A1 | A1